# EAGLE board BusPirate-ultra.v1.0a (EAGLE 9.1.3)
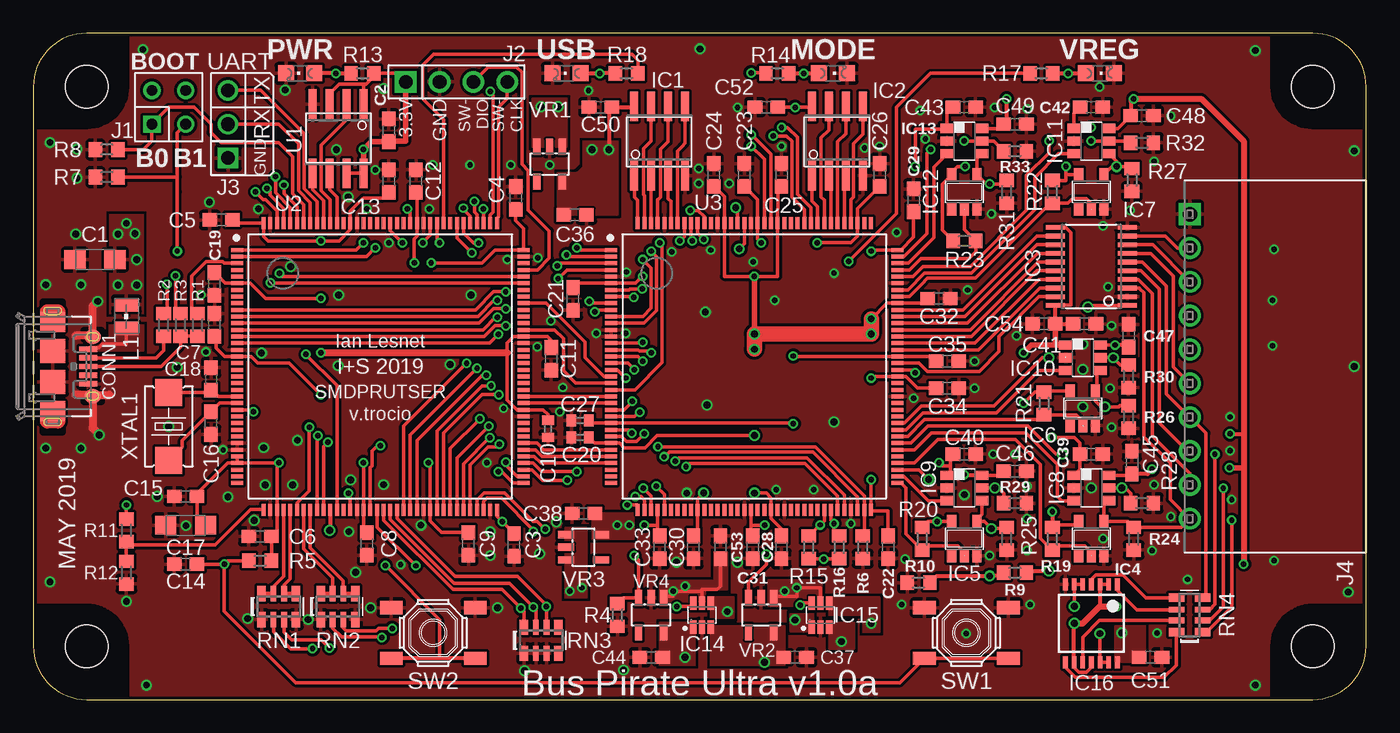
[diagram p5: board, top side]
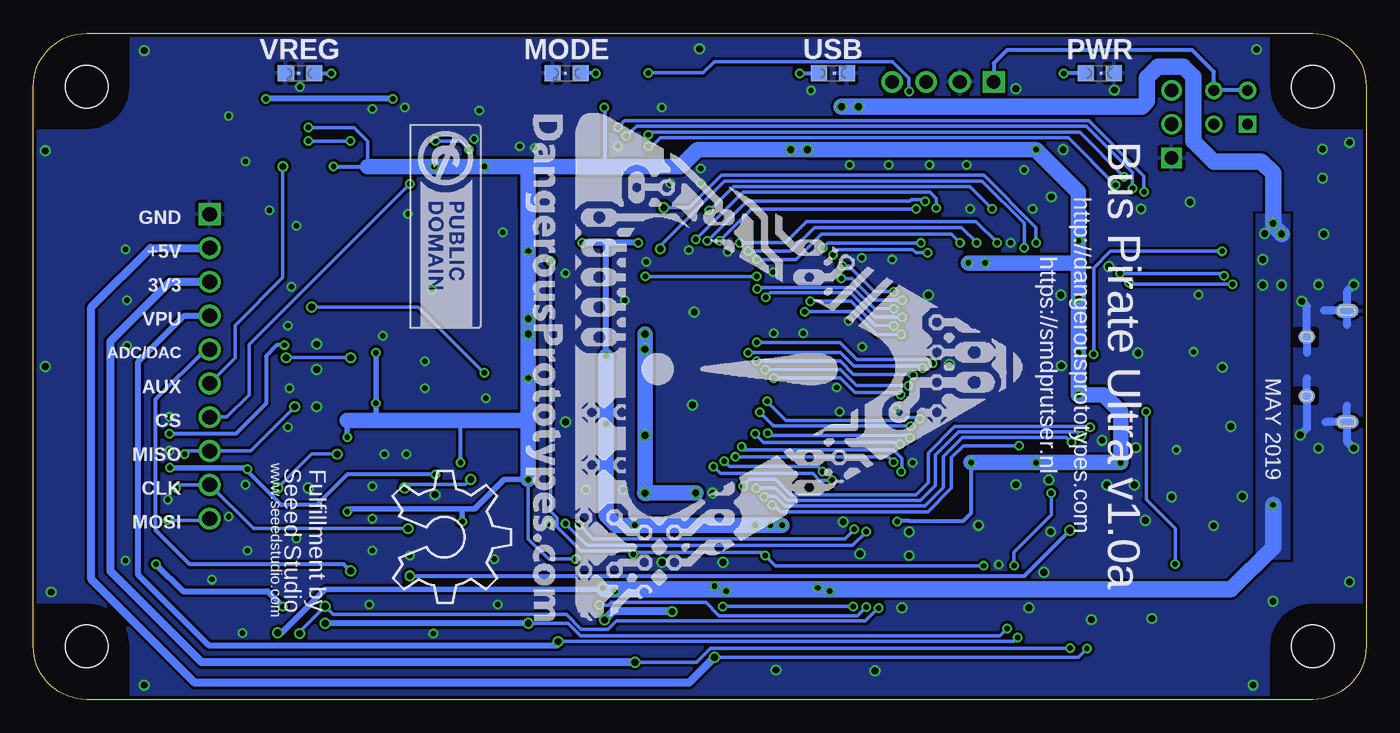
[diagram p6: board, bottom side, seen from below]

Size 100 x 50 mm. Coordinates in mm from the lower left corner, seen from the top.
Copper layers (1*16): Top 0.035mm / dielectric 1.5mm / Bottom 0.035mm
Design rules "dirt_cheap_dirty_boards.v1.1": minimum track width 6mil, minimum drill 12mil, track to track 6mil, track to pad 6mil, pad to pad 6mil, via to via 6mil, smd to smd 0mil, copper to edge 10mil, drill to drill 10mil, minimum pad ring 10mil, minimum via ring 6mil, stop-mask expansion 2mil, vias tented up to drill 25mil, thermal gap 10mil
tRestrict: area 0.8,20.1 to 2.2,20.7; area 0.8,29.2 to 2.2,29.8; area 3.8,22.4 to 5.1,23; area 3.8,27.1 to 5.1,27.7
bRestrict: area 3.8,26.7 to 5.1,27.7; area 3.8,22.4 to 5.1,23.2

## Footprints (pad centres in the part's own frame; a part is rotated, then mirrored left to right if it is on the bottom)
SMC_A = smd 1.6 x 1.4: + -1.5,0; - 1.5,0
C0603 = smd 1.1 x 1: 1 -0.85,0; 2 0.85,0
C402 = smd 0.7 x 0.9: 1 -0.65,0; 2 0.65,0
CON_USB_MICRO-B-2-SD-47589-001 = smd 1.05 x 1.25: BODY@1 -2.225,3.35; BODY@3 2.225,3.35 | smd 1.05 x 1.25 bottom: BODY@2 -2.225,3.35; BODY@4 2.225,3.35 | smd 1.48 x 1.9: BODY@5 -3.338,0.35; BODY@9 3.338,0.35 | smd 1 x 1.7 bottom: BODY@6 -4.175,0.35; BODY@10 4.175,0.35 | smd 1.8 x 1.9: BODY@7 -1.15,0.35; BODY@8 1.15,0.35 | smd 0.4 x 1.35: P1 -1.3,3.025; P2 -0.65,3.025; P3 0,3.025; P4 0.65,3.025; P5 1.3,3.025
SOIC-8 = smd 0.6 x 2.2: 1 -1.905,-2.6; 2 -0.635,-2.6; 3 0.635,-2.6; 4 1.905,-2.6; 5 1.905,2.6; 6 0.635,2.6; 7 -0.635,2.6; 8 -1.905,2.6
TSSOP-20 = smd 0.35 x 1.43: 1 -2.925,-2.7; 2 -2.275,-2.7; 3 -1.625,-2.7; 4 -0.975,-2.7; 5 -0.325,-2.7; 6 0.325,-2.7; 7 0.975,-2.7; 8 1.625,-2.7; 9 2.275,-2.7; 10 2.925,-2.7; 11 2.925,2.7; 12 2.275,2.7; 13 1.625,2.7; 14 0.975,2.7; 15 0.325,2.7; 16 -0.325,2.7; 17 -0.975,2.7; 18 -1.625,2.7; 19 -2.275,2.7; 20 -2.925,2.7
SOT23-5 = smd 0.69 x 0.99: 1 -0.95,-1.29; 2 0,-1.29; 3 0.95,-1.29; 4 0.95,1.3; 5 -0.95,1.3
DBV-R-PDSO-G6 = smd 0.69 x 0.99: 1 -0.95,-1.29; 2 0,-1.29; 3 0.95,-1.29; 4 0.95,1.3; 5 0,1.3; 6 -0.95,1.3
SC-70-6 = smd 0.47 x 1: 1 -0.65,-0.9; 2 0,-0.9; 3 0.65,-0.9; 4 0.65,0.9; 5 0,0.9; 6 -0.65,0.9
40XX_TSSOP14 = smd 0.35 x 0.9: 1 -1.95,-2.925; 2 -1.3,-2.925; 3 -0.65,-2.925; 4 0,-2.925; 5 0.65,-2.925; 6 1.3,-2.925; 7 1.95,-2.925; 8 1.95,2.925; 9 1.3,2.925; 10 0.65,2.925; 11 0,2.925; 12 -0.65,2.925; 13 -1.3,2.925; 14 -1.95,2.925
M2X2 = drill 0.8 square: 1 -1.27,-1.27 | drill 0.8: 2 -1.27,1.27; 3 1.27,-1.27; 4 1.27,1.27
M1X4 = drill 1.02 pad 1.632 square: 1 0,0 | drill 1.02 pad 1.632: 2 2.54,0; 3 5.08,0; 4 7.62,0
M1X3 = drill 1.02 square: 1 0,0 | drill 1.02: 2 2.54,0; 3 5.08,0
M1X10_MALE_RIGHT_ANGLES_PTH_SHROUDED = drill 1.09 square: 1 -11.43,-6.415 | drill 1.09: 2 -8.89,-6.415; 3 -6.35,-6.415; 4 -3.81,-6.415; 5 -1.27,-6.415; 6 1.27,-6.415; 7 3.81,-6.415; 8 6.35,-6.415; 9 8.89,-6.415; 10 11.43,-6.415
WE-KI_0805_B = smd 1.02 x 1.78: 1 -0.89,0; 2 0.89,0
LED-805 = smd 1.2 x 1.2: A 0,-1.05; C 0,1.05
DP10050_V1 = hole 3.2: 4,4; 96,4; 96,46; 4,46
R603 = smd 1 x 1.1: 1 -0.85,0; 2 0.85,0
R0603 = smd 1 x 1.1: 1 -0.85,0; 2 0.85,0
RN8P-4R-CRA06S = smd 0.63 x 1.15: 1 -1.295,-0.975; 4 1.295,-0.975; 5 1.295,0.975; 8 -1.295,0.975 | smd 0.44 x 1.15: 2 -0.4,-0.975; 3 0.4,-0.975; 6 0.4,0.975; 7 -0.4,0.975
SW_TACT_SMALL = smd 1.7 x 1: 1 -3.15,1.9; 2 3.15,1.9; 3 -3.15,-1.9; 4 3.15,-1.9
TQFP-144 = smd 0.9 x 0.3: 1 -10.75,8.75; 2 -10.75,8.25; 3 -10.75,7.75; 4 -10.75,7.25; 5 -10.75,6.75; 6 -10.75,6.25; 7 -10.75,5.75; 8 -10.75,5.25; 9 -10.75,4.75; 10 -10.75,4.25; 11 -10.75,3.75; 12 -10.75,3.25; 13 -10.75,2.75; 14 -10.75,2.25; 15 -10.75,1.75; 16 -10.75,1.25; 17 -10.75,0.75; 18 -10.75,0.25; 19 -10.75,-0.25; 20 -10.75,-0.75; 21 -10.75,-1.25; 22 -10.75,-1.75; 23 -10.75,-2.25; 24 -10.75,-2.75; 25 -10.75,-3.25; 26 -10.75,-3.75; 27 -10.75,-4.25; 28 -10.75,-4.75; 29 -10.75,-5.25; 30 -10.75,-5.75; 31 -10.75,-6.25; 32 -10.75,-6.75; 33 -10.75,-7.25; 34 -10.75,-7.75; 35 -10.75,-8.25; 36 -10.75,-8.75; 73 10.75,-8.75; 74 10.75,-8.25; 75 10.75,-7.75; 76 10.75,-7.25; 77 10.75,-6.75; 78 10.75,-6.25; 79 10.75,-5.75; 80 10.75,-5.25; 81 10.75,-4.75; 82 10.75,-4.25; 83 10.75,-3.75; 84 10.75,-3.25; 85 10.75,-2.75; 86 10.75,-2.25; 87 10.75,-1.75; 88 10.75,-1.25; 89 10.75,-0.75; 90 10.75,-0.25; 91 10.75,0.25; 92 10.75,0.75; 93 10.75,1.25; 94 10.75,1.75; 95 10.75,2.25; 96 10.75,2.75; 97 10.75,3.25; 98 10.75,3.75; 99 10.75,4.25; 100 10.75,4.75; 101 10.75,5.25; 102 10.75,5.75; 103 10.75,6.25; 104 10.75,6.75; 105 10.75,7.25; 106 10.75,7.75; 107 10.75,8.25; 108 10.75,8.75 | smd 0.3 x 0.9: 37 -8.75,-10.75; 38 -8.25,-10.75; 39 -7.75,-10.75; 40 -7.25,-10.75; 41 -6.75,-10.75; 42 -6.25,-10.75; 43 -5.75,-10.75; 44 -5.25,-10.75; 45 -4.75,-10.75; 46 -4.25,-10.75; 47 -3.75,-10.75; 48 -3.25,-10.75; 49 -2.75,-10.75; 50 -2.25,-10.75; 51 -1.75,-10.75; 52 -1.25,-10.75; 53 -0.75,-10.75; 54 -0.25,-10.75; 55 0.25,-10.75; 56 0.75,-10.75; 57 1.25,-10.75; 58 1.75,-10.75; 59 2.25,-10.75; 60 2.75,-10.75; 61 3.25,-10.75; 62 3.75,-10.75; 63 4.25,-10.75; 64 4.75,-10.75; 65 5.25,-10.75; 66 5.75,-10.75; 67 6.25,-10.75; 68 6.75,-10.75; 69 7.25,-10.75; 70 7.75,-10.75; 71 8.25,-10.75; 72 8.75,-10.75; 109 8.75,10.75; 110 8.25,10.75; 111 7.75,10.75; 112 7.25,10.75; 113 6.75,10.75; 114 6.25,10.75; 115 5.75,10.75; 116 5.25,10.75; 117 4.75,10.75; 118 4.25,10.75; 119 3.75,10.75; 120 3.25,10.75; 121 2.75,10.75; 122 2.25,10.75; 123 1.75,10.75; 124 1.25,10.75; 125 0.75,10.75; 126 0.25,10.75; 127 -0.25,10.75; 128 -0.75,10.75; 129 -1.25,10.75; 130 -1.75,10.75; 131 -2.25,10.75; 132 -2.75,10.75; 133 -3.25,10.75; 134 -3.75,10.75; 135 -4.25,10.75; 136 -4.75,10.75; 137 -5.25,10.75; 138 -5.75,10.75; 139 -6.25,10.75; 140 -6.75,10.75; 141 -7.25,10.75; 142 -7.75,10.75; 143 -8.25,10.75; 144 -8.75,10.75
SOT-23-5@1 = smd 0.55 x 1.2: 1 -0.95,-1.3; 2 0,-1.3; 3 0.95,-1.3; 4 0.95,1.3; 5 -0.95,1.3
XTAL_4X6 = smd 2.032 x 2.032: 1 -2.54,0; 2 2.54,0

## Placement (x,y rotation side)
C1  10uF  [SMC_A]  4.62,33.02 180 top
C2  0.1uF  [C0603]  26.67,42.72 270 top
C3  0.1uF  [C0603]  36.07,11.61 90 top
C4  0.1uF  [C0603]  36.2,37.64 270 top
C5  0.1uF  [C0603]  14.1,35.99 0 top
C6  0.1uF  [C0603]  17.02,12.24 0 top
C7  0.1uF  [C0603]  13.59,28.11 270 top
C8  0.1uF  [C0603]  25.02,11.68 90 top
C9  0.1uF  [C0603]  32.64,11.68 90 top
C10  0.1uF  [C402]  38.61,20.32 270 top
C11  0.1uF  [C0603]  38.86,25.57 90 top
C12  0.1uF  [C0603]  28.7,38.91 270 top
C13  0.1uF  [C0603]  26.67,38.91 270 top
C14  0.1uF  [C0603]  11.43,10.16 0 top
C15  0.1uF  [C0603]  11.43,15.24 0 top
C16  22pF  [C0603]  13.34,20.75 90 top
C17  1uF  [SMC_A]  11.43,13.08 180 top
C18  22pF  [C0603]  13.34,24.05 270 top
C19  0.1uF  [C0603]  13.59,31.19 90 top
C20  0.1uF  [C402]  41.02,19.68 180 top
C21  0.1uF  [C0603]  40.49,30.07 90 top
C22  0.1uF  [C0603]  64.14,11.43 90 top
C23  0.1uF  [C0603]  53.34,39.37 270 top
C24  0.1uF  [C0603]  51.05,39.37 270 top
C25  0.1uF  [C0603]  56.13,39.37 270 top
C26  0.1uF  [C0603]  63.5,39.37 270 top
C27  0.1uF  [C402]  41.02,20.95 180 top
C28  0.1uF  [C0603]  56.13,11.43 90 top
C29  0.1uF  [C0603]  66.04,37.47 270 top
C30  0.1uF  [C0603]  49.53,11.43 90 top
C31  0.1uF  [C0603]  53.98,11.43 90 top
C32  0.1uF  [C0603]  67.94,30.1 180 top
C33  0.1uF  [C0603]  46.99,11.43 90 top
C34  0.1uF  [C0603]  68.58,23.37 180 top
C35  0.1uF  [C0603]  68.58,25.4 180 top
C36  1uf  [C0603]  40.64,36.37 0 top
C37  1uF  [C0603]  57.15,3.17 0 top
C38  1uf  [C0603]  41.27,13.97 180 top
C39  0.1uF  [C0603]  79.38,18.41 0 top
C40  0.1uF  [C0603]  69.85,18.41 0 top
C41  0.1uF  [C0603]  78.87,28.19 0 top
C42  0.1uF  [C0603]  79.38,44.45 0 top
C43  0.1uF  [C0603]  69.85,44.45 0 top
C44  1uF  [C0603]  46.35,3.17 180 top
C45  0.1uF  [C0603]  82.42,17.78 270 top
C46  0.1uF  [C0603]  73.66,17.14 180 top
C47  0.1uF  [C0603]  82.17,27.3 270 top
C48  0.1uF  [C0603]  83.19,43.81 180 top
C49  0.1uF  [C0603]  73.66,43.18 180 top
C50  0.1uF  [C0603]  42.55,44.45 180 top
C51  0.1uF  [C0603]  83.82,3.17 0 top
C52  0.1uF  [C0603]  54.99,44.45 180 top
C53  0.1uF  [C0603]  51.56,11.43 90 top
C54  0.1uF  [C0603]  75.82,28.19 180 top
CONN1  CON-USB-F-MICRO-B-2  [CON_USB_MICRO-B-2-SD-47589-001]  1.1,25 270 top
IC1  IC_MEM_23LC1024  [SOIC-8]  46.99,41.91 0 top
IC2  IC_MEM_23LC1024  [SOIC-8]  60.33,41.91 0 top
IC3  IC_74AC573  [TSSOP-20]  79.38,32.51 90 top
IC4  74LVC1G07DBV  [SOT23-5]  79.38,12.06 0 top
IC5  74LVC1G07DBV  [SOT23-5]  69.85,12.06 0 top
IC6  74LVC1G07DBV  [SOT23-5]  78.74,21.84 0 top
IC7  74LVC1G07DBV  [SOT23-5]  79.38,38.1 0 top
IC8  IC_BUFF_SN74LVC1T45DBV  [DBV-R-PDSO-G6]  79.38,15.88 270 top
IC9  IC_BUFF_SN74LVC1T45DBV  [DBV-R-PDSO-G6]  69.85,15.88 270 top
IC10  IC_BUFF_SN74LVC1T45DBV  [DBV-R-PDSO-G6]  78.74,25.65 270 top
IC11  IC_BUFF_SN74LVC1T45DBV  [DBV-R-PDSO-G6]  79.38,41.91 270 top
IC12  74LVC1G07DBV  [SOT23-5]  69.85,38.1 0 top
IC13  IC_BUFF_SN74LVC1T45DBV  [DBV-R-PDSO-G6]  69.85,41.91 270 top
IC14  IC_BL1551  [SC-70-6]  50.16,6.35 0 top
IC15  IC_BL1551  [SC-70-6]  59.05,6.35 0 top
IC16  74HCT4066PW  [40XX_TSSOP14]  79.38,5.71 180 top
J1  CON_HEADER_2X02-PTH  [M2X2]  10.16,44.45 0 top
J2  CON_HEADER_1X04  [M1X4]  27.94,46.35 0 top
J3  CON_HEADER_1X03-PTH  [M1X3]  14.61,40.64 90 top
J4  CON_HEADER_1X10-RIGHT_ANGLED_PTH_SHROUDED  [M1X10_MALE_RIGHT_ANGLES_PTH_SHROUDED]  93.19,25 270 top
L1  1.5A ferrite bead  [WE-KI_0805_B]  6.99,28.75 270 top
LED1  Optional YELLOW  [LED-805]  20,47 270 bottom
LED2  YELLOW  [LED-805]  20,47 90 top
LED3  YELLOW  [LED-805]  60,47 270 top
LED4  Optional YELLOW  [LED-805]  60,47 90 bottom
LED5  YELLOW  [LED-805]  80,47 270 top
LED6  Optional YELLOW  [LED-805]  80,47 90 bottom
LED7  YELLOW  [LED-805]  40,47 90 top
LED8  Optional YELLOW  [LED-805]  40,47 270 bottom
LOGO1  LOGO_CC-0  [LOGO_CC-0]  71.75,43.18 270 bottom
PCB1  PCB_DP_RECTANGLE-50X100  [DP10050_V1]  0,0 0 top
R1  1.5K  [R603]  12.32,28.11 90 top
R2  22R  [R603]  9.78,28.11 270 top
R3  22R  [R603]  11.05,28.11 270 top
R4  10K  [R603]  43.81,6.35 270 top
R5  10K  [R603]  17.02,10.41 0 top
R6  10K  [R603]  62.23,11.43 270 top
R7  10K  [R0603]  5.51,39.21 180 top
R8  10K  [R0603]  5.51,41.27 180 top
R9  10K  [R0603]  73.66,9.53 180 top
R10  10K  [R0603]  66.42,8.76 0 top
R11  10K  [R0603]  6.99,12.7 270 top
R12  10K  [R0603]  6.99,9.53 90 top
R13  1K1  [R603]  24.7,47 0 top
R14  1K1  [R603]  55.81,47 180 top
R15  10K  [R0603]  58.17,11.43 270 top
R16  10K  [R0603]  60.45,11.43 270 top
R17  1K1  [R603]  75.62,47 180 top
R18  1K1  [R603]  44.51,47 0 top
R19  100K  [R0603]  76.45,12.06 90 top
R20  100K  [R0603]  66.67,12.06 90 top
R21  100K  [R0603]  75.82,22.23 90 top
R22  100K  [R0603]  76.45,38.1 90 top
R23  100K  [R0603]  69.85,34.42 180 top
R24  1M  [R0603]  82.55,12.06 90 top
R25  1M  [R0603]  73.03,12.06 90 top
R26  1M  [R0603]  82.17,21.21 90 top
R27  1M  [R0603]  82.42,38.99 90 top
R28  100K  [R0603]  83.19,14.73 180 top
R29  100K  [R0603]  73.66,14.73 180 top
R30  100K  [R0603]  82.17,24.26 90 top
R31  1M  [R0603]  73.03,38.1 90 top
R32  100K  [R0603]  83.19,41.78 180 top
R33  100K  [R0603]  73.66,41.15 180 top
RN1  10k  [RN8P-4R-CRA06S]  18.41,6.99 0 top
RN2  10k  [RN8P-4R-CRA06S]  22.86,6.99 0 top
RN3  10k  [RN8P-4R-CRA06S]  38.1,4.45 0 top
RN4  10k  [RN8P-4R-CRA06S]  86.74,6.35 90 top
SW1  [SW_TACT_SMALL]  70,5 180 top
SW2  [SW_TACT_SMALL]  30,5 180 top
U1  IC_MEM_W25X40CL  [SOIC-8]  22.86,42.09 180 top
U2  IC_UC_STM32F103ZX  [TQFP-144]  26.04,25 0 top
U3  IC_FPGA_ICE40HX4K  [TQFP-144]  54.09,25 0 top
U$1  [DP-LOGO]  61.84,-11.22 0 top  (outside the outline)
U$2  [OSHW_8X350_NOTEXT]  73.03,17.14 270 bottom
U$4  [DP_LOGO_ART_1.5X1.5]  63.01,43.98 270 bottom
VR1  MCP1801T-3302I/OT  [SOT-23-5@1]  38.73,40.18 180 top
VR2  MCP1801T-3302I/OT  [SOT-23-5@1]  54.61,6.35 180 top
VR3  MCP1801T-1202I/OT  [SOT-23-5@1]  41.27,11.43 270 top
VR4  MCP1801T-5002I/OT  [SOT-23-5@1]  46.35,6.35 180 top
XTAL1  8Mhz  [XTAL_4X6]  10.16,20.5 90 top

## Tracks (layer width: path | path; a pad name or v marks a point on that pad's centre or on a via)
1V2  (via drill 0.41)
  Top 0.254: C33.2 46.84,12.43 U3.40 46.84,13.08 v45.85,13.08 | 53.84,13.08 53.84,12.42 C31.2 | C35.2 67.38,25.75 U3.92 57.05,25.75 v57.02,25.78 | C23.2 54.34,37.52 U3.126 54.34,34.56 v54.61,34.29 | C27.1 41.67,20.75 U3.27 45.26,20.75 56.97,20.75 v57.02,20.7 | v54.86,13.08 53.84,13.08 | C26.2 61.84,36.86 U3.111 61.84,34.79 61.34,34.29 v58.8,34.29 | U3.54 53.84,13.08
  Bottom 0.457: v57.02,25.78 57.02,34.29 | v58.8,34.29 57.02,34.29 | v54.61,34.29 57.02,34.29
  Bottom 1.168: v43.81,13.08 v45.85,13.08 46.86,13.08 48.26,13.08 v54.86,13.08 56.26,13.08 57.02,13.84 57.02,17.27 v57.02,20.7 v57.02,25.78
  other vias: 44.7,13.08
  pour Top (no thermals): 45.09,13.97 41.91,13.97 41.91,12.06 45.09,12.06
3V3  (via drill 0.41, 0.51)
  Top 0.254: C12.2 28.79,37.98 U2.121 28.79,34.76 28.57,34.55 v28.57,32.77 | C5.2 15.19,35.75 U2.144 17.29,34.75 17.61,34.42 v21.59,34.42 22.95,34.42 23.79,35.26 U2.131 23.79,36.66 24.68,37.55 | C11.2 38.86,26.97 38.58,27.25 U2.95 36.04,27.25 35.56,26.77 35.56,26.04 35.56,22.48 36.29,21.75 U2.84 38.25,21.75 38.61,21.39 C10.1 | 24.68,37.55 24.77,37.64 | 24.77,37.64 26.25,37.64 C13.2 | C22.2 64.14,14.14 62.94,14.14 U3.72 62.84,16.48 v62.87,16.51 | C7.2 13.72,27.14 13.72,26.38 14.34,25.75 U2.17 16.34,25.75 16.82,25.27 19.18,25.27 v21.59,22.86 | C8.2 24.79,12.56 U2.52 24.79,17.76 v24.77,17.78 | C30.2 49.84,12.59 U3.46 49.84,15.06 v50.29,15.51 | C32.2 66.75,29.75 U3.100 64.04,29.75 v62.87,28.57 | U2.72 34.78,13.74 | 34.78,13.74 C3.2 | IC8.1 78.53,17.27 C39.1 78.53,19.27 78.11,19.68 v76.45,19.68 | C42.1 78.08,44.01 IC11.1 79.31,42.86 v79.38,42.93 | C43.1 68.56,44.01 IC13.1 68.5,42.8 66.17,42.8 v66.17,40.01 | R19.2 76.65,13.11 78.17,13.11 IC4.5 | C20.1 42.11,19.25 U3.30 43.96,19.25 44.34,18.88 45.88,18.88 46.81,19.81 v54.1,19.81 | J2.1 27.3,47 R13.2 25.55,46.75 24.97,46.17 24.77,46.17 | U2.33 14.57,17.75 12.28,15.46 C15.2 12.28,13.73 C17.+ | C25.2 55.88,38.27 55.88,36.83 55.84,36.79 U3.123 55.84,31.75 v54.1,31.75 51.84,31.75 U3.131 51.84,37.73 C24.2 | C34.2 66.33,23.37 65.45,24.25 U3.89 62.98,24.25 v62.87,24.13 | IC5.5 v67.82,13.37 67.12,13.37 R20.2 | 68.81,17.53 68.81,16.89 68.75,16.82 IC9.1 | 68.81,17.53 68.81,18.23 C40.1 | v62.87,33.66 62.96,33.75 U3.108 65.08,33.75 66.04,34.71 C29.2 | R22.2 77.47,38.95 77.47,39.37 | v77.47,40.01 77.47,39.37 | IC7.5 77.5,39.4 77.47,39.37 | v69.9,40.01 69.34,40.01 68.9,39.56 IC12.5 68.2,38.7 68.2,35.22 R23.2
  Top 0.254: IC3.11 77.47,35.44 77.85,35.05 77.85,29.59 IC3.20 | IC6.5 75.89,23.14 R21.2 75.14,23.07 v74.3,22.23 | 68.81,17.53 68.2,17.53 v67.94,17.78 | IC2.8 58.36,44.45 v57.15,44.45 C52.1 | U2.33 18.39,17.75 v18.41,17.78 18.29,17.65 U2.39 18.29,12.66 C6.2 R5.2 | U2.32 U2.33 | v29.65,17.78 29.79,17.64 U2.62 29.79,13.39 30.65,12.53 C9.2 | 34.78,13.74 34.8,13.74 v35.19,13.35 | v29.84,32.77 33.66,32.77 34.41,33.52 34.42,33.52 34.65,33.75 U2.108 36.78,35.35 36.2,35.94 C4.2 | C19.2 14.38,31.25 U2.6 16.27,31.25 17.42,30.1 v21.59,30.1 | v45.72,31.75 45.69,31.75 45.19,31.25 U3.6 42.55,31.25 40.81,31.25 C21.2 | C28.2 56.13,12.79 55.34,13.58 U3.57 55.34,15.15 54.99,15.49 v54.1,15.49 | R16.2 60.41,10.54 v59.31,10.54 58.2,10.54 R15.2 | 24.68,37.55 24.77,37.64 | U1.7 U1.8 | 24.77,46.17 22.93,46.17 22.23,45.47 U1.3 | U1.1 24.77,46.17
  Top 0.305: IC1.8 45.02,44.45 C50.1 43.18,44.23 v43.18,41.27 | IC3.20 C54.1 C41.1 | v76.45,14.1 R19.2
  Top 0.406: IC10.1 76.58,26.6 | 76.58,26.6 74.86,26.6 v74.3,26.04 | C54.1 76.67,26.69 76.58,26.6 | J2.1 27.94,41.91 26.71,41.91 C2.2 25.36,41.87 v24.77,41.27 U1.8 | v54.1,27.43 v54.1,31.75
  Top 0.508: v21.59,26.04 35.56,26.04
  Top 1.168: v62.87,28.57 v62.87,27.43 v54.1,27.43 v54.1,26.29
  Bottom 0.254: v45.72,31.75 49.53,31.75 v54.1,31.75 | v62.87,16.51 62.87,12.06 61.34,10.54 v59.31,10.54 | v79.38,42.93 75.95,42.93 74.93,41.91 74.93,40.01
  Bottom 0.305: J1.2 J1.4 11.43,47.12 13.06,48.74 26.95,48.74 27.94,47.75 J2.1 | v67.94,17.78 67.94,20.95 | v77.47,40.01 74.93,40.01 | v57.15,44.45 57.15,40.01 | v29.65,17.78 29.65,13.97 30.21,13.41 34.29,13.41 35.13,13.41 v35.19,13.35
  Bottom 0.406: v74.3,26.04 v74.3,22.23 74.3,20.95 | 76.45,20.95 v76.45,19.68 | v62.87,16.51 64.67,16.51 66.63,14.56 66.88,14.3 67.94,14.3 | v76.45,14.1 v76.44,14.1 76.24,14.3 67.94,14.3 | 67.94,14.3 67.82,14.3 67.82,14.1 v67.82,13.37
  Bottom 1.168: 62.87,20.95 v62.87,24.13 v62.87,28.57 62.87,29.84 v62.87,33.66 62.87,36.83 62.87,40.01 | 62.87,20.95 v62.87,16.51 | 62.87,40.01 v66.17,40.01 v69.9,40.01 74.93,40.01 | 62.87,20.95 67.94,20.95 74.3,20.95 76.45,20.95 | v29.65,17.78 v24.77,17.78 21.59,17.78 v18.41,17.78 18.41,21.59 19.68,22.86 v21.59,22.86 v21.59,26.04 v21.59,30.1 21.59,32.77 | 21.59,32.77 v21.59,34.42 21.59,37.34 21.59,38.1 v24.77,41.27 27.94,41.27 v41.91,41.27 50.16,41.27 51.44,40.01 56.52,40.01 57.15,40.01 62.87,40.01 | 21.59,32.77 v28.57,32.77 v29.84,32.77 | v50.29,15.51 50.29,15.49 53.98,15.49 | v54.1,27.43 v54.1,19.81 v54.1,15.49
  Bottom 1.219: v54.1,15.49 53.98,15.49
  pour Top (no thermals): 39.37,39.55 40.81,39.55 41.27,40.01 41.27,41.91 43.81,41.91 43.81,36.37 39.37,36.37
ADC1  (via drill 0.51)
  Top 0.305: U2.47 22.29,12.76 v22.23,12.7 | R10.2 67.78,9.27 v71.75,9.27 72.56,9.27 R9.2
  Bottom 0.305: v71.75,9.27 25.65,9.27 v22.23,12.7
ADC2
  Top 0.254: RN2.8 RN2.7 22.46,9.13 20.29,11.31 U2.43
ADC3
  Top 0.254: RN1.5 RN1.6 18.82,8.59 19.29,9.06 U2.41
ADC4
  Top 0.254: RN1.8 RN1.7 18.02,8.49 18.79,9.26 U2.40
ADC5
  Top 0.254: U2.37 17.27,14.26 16.3,14.26 13.64,11.61 7.23,11.61 R11.2 R12.2
ADC6
  Top 0.254: RN2.5 RN2.6 23.26,8.91 20.79,11.38 U2.44
BOOT0
  Top 0.254: U2.138 20.29,37.13 19.44,37.98 19.44,40.76 18.41,41.78 14.1,41.78 13.34,42.55 13.34,43.18 12.06,44.45 10.16,44.45 J1.1 8.89,41.91 8.26,41.27 R8.1
BOOT1  (via drill 0.41)
  Top 0.254: v10.79,33.66 10.79,38.1 10.79,39.24 | 10.79,39.24 10.79,42.55 J1.3 | R7.1 10.76,39.21 10.79,39.24 | U2.48 22.79,23.57 v20.45,25.91
  Bottom 0.254: v20.45,25.91 20.45,32.38 19.18,33.66 v10.79,33.66
BPIO_AUX  (via drill 0.51)
  Top 0.254: v81.28,40.01 82.26,40.01 R27.2 | IC11.4 81.28,40.35 v81.28,40.01 | IC7.4 80.93,40.01 v81.28,40.01 | IC3.7 83.85,33.49 85.55,31.79 85.55,24.95 J4.6
  Bottom 0.254: J4.6 84.86,25.64 84.86,28.07 81.28,31.65 v81.28,40.01
BPIO_CLOCK  (via drill 0.41, 0.51)
  Top 0.254: IC9.4 71.15,13.91 70.8,13.56 IC5.4 71.34,13.37 v71.88,12.83 73.11,12.83 72.73,13.21 72.81,13.12 R25.2 | J4.9 86.76,16.98 83.95,19.8 83.95,30.48 82.89,31.54 IC3.4 | RN4.2 88.27,5.95 89.28,6.97 v89.28,15.88
  Bottom 0.254: v89.28,15.88 89.05,16.11 J4.9 83.49,12.83 v71.88,12.83
BPIO_CS  (via drill 0.41)
  Top 0.254: IC13.4 70.8,40.61 IC12.4 71.5,38.7 v71.75,38.7 72.77,38.7 R31.2 | IC3.6 83.22,32.84 85.01,31.04 85.01,22.92 86.74,21.19 J4.7 87.97,19.99 87.97,7.9 RN4.4
  Bottom 0.254: v71.75,38.7 83.82,26.63 83.82,22.86 85.49,21.19 J4.7
BPIO_MISO  (via drill 0.41, 0.51)
  Top 0.254: IC10.4 79.79,24.45 79.79,23.24 IC6.4 79.69,22.42 80.14,21.97 v80.39,21.97 81.45,21.97 81.53,22.06 R26.2 | RN4.3 88.27,6.75 88.65,7.13 v88.65,18.41 | J4.8 86.59,18.65 84.48,20.77 84.48,30.79 83.08,32.19 IC3.5
  Bottom 0.254: v88.65,18.41 88.41,18.65 J4.8 83.71,18.65 v80.39,21.97
BPIO_MOSI  (via drill 0.41)
  Top 0.254: IC8.4 80.33,14.57 IC4.4 82.1,13.37 R24.2 86.11,12.91 J4.10 86.74,13.57 85.29,15.02 85.29,17.75 83.32,19.72 83.32,30.53 83.03,30.82 | 83.03,30.82 82.96,30.89 IC3.3 | 83.03,30.82 | v89.92,13.46 89.92,6.96 88.01,5.05 RN4.1
  Bottom 0.254: v89.92,13.46 86.88,13.46 J4.10
BUFDIR_AUX  (via drill 0.41)
  Top 0.254: v79.38,41.91 IC11.5 82.21,41.91 R32.2 | U3.104 65.98,31.75 66.74,32.51 70.3,32.51 74.52,36.73 74.52,39.34 76.2,41.02 v76.2,41.91
  Bottom 0.254: v76.2,41.91 v79.38,41.91
BUFDIR_CLOCK  (via drill 0.51)
  Top 0.254: U3.75 66.42,17.25 67.17,16.51 v67.18,16.51 | IC9.5 v72.14,15.88 72.39,15.88 72.81,15.46 R29.2
  Bottom 0.254: v72.14,15.88 71.88,16.13 67.56,16.13 v67.18,16.51
BUFDIR_CS  (via drill 0.41)
  Top 0.254: v69.85,41.91 IC13.5 72.07,41.91 72.86,41.12 R33.2 | U3.107 65.33,33.25 67.06,34.97 67.06,41.02 v67.31,41.27
  Bottom 0.254: v67.31,41.27 67.94,41.91 v69.85,41.91
BUFDIR_MISO  (via drill 0.51)
  Top 0.254: v81.03,25.65 IC10.5 81.02,25.65 81.56,25.11 R30.2 | U3.82 65.35,20.75 66.62,22.02 72.06,22.02 75.69,25.65 v76.2,25.65
  Bottom 0.254: v76.2,25.65 v81.03,25.65
BUFDIR_MOSI  (via drill 0.51)
  Top 0.254: IC8.5 v81.66,15.88 81.92,15.88 82.33,15.46 R28.2 | U3.79 65.86,19.25 67.12,20.52 74.6,20.52 76.71,18.41 v77.22,18.41
  Bottom 0.254: v81.66,15.88 79.12,18.41 v77.22,18.41
BUFIO_AUX
  Top 0.254: U3.102 65.6,30.75 66.87,32.02 70.39,32.02 75.13,36.76 75.13,39.19 76.9,40.96 IC11.3
BUFIO_CLOCK
  Top 0.254: IC9.3 67.16,14.93 65.33,16.75 U3.74
BUFIO_CS
  Top 0.254: U3.106 65.66,32.75 67.56,34.65 67.56,39.94 67.94,40.33 67.94,40.34 IC13.3
BUFIO_MISO
  Top 0.254: U3.81 65.47,20.25 66.74,21.52 72.25,21.52 75.44,24.7 IC10.3
BUFIO_MOSI
  Top 0.254: U3.78 66.11,18.75 67.38,20.02 74.47,20.02 76.83,17.65 76.83,15.24 77.15,14.93 IC8.3
BUFOD_AUX
  Top 0.254: 66.63,31.16 65.73,30.25 U3.101 | 66.63,31.16 67.09,31.61 70.68,31.61 76.32,37.25 R22.1 77.63,37.25 77.96,37.58 79.01,37.58 79.38,37.22 IC7.2 | 66.63,31.16
BUFOD_CLOCK
  Top 0.254: IC5.2 69.85,11.06 69.36,11.55 67.01,11.55 66.78,11.32 R20.1 65.47,12.43 65.47,15.88 65.09,16.25 U3.73
BUFOD_CS
  Top 0.254: IC12.2 69.85,35.25 70.67,34.44 R23.1 70.7,33.62 70.19,33.1 66.59,33.1 65.74,32.25 U3.105
BUFOD_MISO
  Top 0.254: IC6.2 78.74,20.84 78.24,21.34 75.91,21.34 75.88,21.38 R21.1 75.46,21.02 66.87,21.02 65.6,19.75 U3.80
BUFOD_MOSI
  Top 0.254: IC4.2 79.38,11.06 78.89,11.55 76.83,11.55 76.79,11.55 R19.1 75.56,12.1 75.56,17.65 73.69,19.53 67.89,19.53 66.11,17.75 U3.76
D+
  Top 0.254: R1.1 R3.2 11.05,26.46 9.59,25 CONN1.P3
D-
  Top 0.254: R2.2 9.78,26.21 9.22,25.65 CONN1.P2
EXVUSB
  Top 0.254: CONN1.P1 4.25,26.42 4.93,26.42 5.18,26.67 6.99,26.67 L1.2
  pour Top (no thermals): 4.86,27.16 5.71,27.16 5.71,28.11 8.26,28.11 8.26,26.16 4.86,26.16 4.86,26.28
FLASH_MISO
  Top 0.254: U2.134 22.29,37.52 21.59,38.21 21.59,41.61 23.5,43.52 U1.2
FLASH_MOSI
  Top 0.254: U2.135 21.79,37.44 21.04,38.19 | 21.04,38.19 20.95,38.27 | 21.04,38.19 20.95,38.27 | 20.95,38.27 U1.5
FLASH_SCK
  Top 0.254: U2.133 22.79,37.72 22.31,38.19 | 22.31,38.19 22.23,38.27 | 22.31,38.19 22.23,38.27 | 22.23,38.27 U1.6
FPGA_CDONE  (via drill 0.41)
  Top 0.254: U3.65 59.34,13.41 v59.03,13.11 58.21,12.28 R15.1 | U2.69 33.28,15 33.81,15.52 35.38,15.52 37.51,13.38 37.79,13.38 v38.4,12.78
  Bottom 0.254: v59.03,13.11 57.99,12.06 39.12,12.06 v38.41,12.78 v38.4,12.78
FPGA_CRESET  (via drill 0.41)
  Top 0.254: U3.66 59.84,13.44 v60.07,13.21 60.07,12.66 R16.1 | U2.70 33.78,14.86 34.04,15.11 35.14,15.11 37.51,12.74 v37.51,12.62
  Bottom 0.254: v60.07,13.21 60.07,13.18 58.45,11.56 38.54,11.56 37.51,12.59 v37.51,12.62
FPGA_PROG_CLOCK  (via drill 0.41)
  Top 0.254: U3.70 61.84,15.22 58.5,18.57 47.75,18.57 47.39,18.21 v47.32,18.21 | U2.74 36.28,16.75 35.46,17.57 v35.46,17.83
  Bottom 0.254: v47.32,18.21 35.84,18.21 v35.46,17.83
FPGA_PROG_CS  (via drill 0.41)
  Top 0.254: R6.1 62.34,12.39 U3.71 62.34,15.3 58.66,18.97 47.62,18.97 v46.87,18.97 | U2.73 35.99,16.25 35.13,17.1 v34.88,17.1
  Bottom 0.254: v46.87,18.97 46.64,18.74 35.48,18.74 34.82,18.09 34.82,17.16 v34.88,17.1
FPGA_PROG_MISO  (via drill 0.41)
  Top 0.254: U2.75 37.41,17.25 38.2,16.46 v40.06,16.46 | U3.67 60.34,15.28 57.89,17.73 49.23,17.73 v48.97,17.47
  Bottom 0.254: v48.97,17.47 48.45,16.95 41.52,16.95 41.02,16.46 v40.06,16.46
FPGA_PROG_MOSI  (via drill 0.41)
  Top 0.254: v40.77,17.11 38.14,17.11 37.51,17.75 U2.76 | U3.68 60.84,15.36 58.06,18.13 48.41,18.13 v48.16,17.88
  Bottom 0.254: v48.16,17.88 47.78,17.5 41.15,17.5 v40.77,17.11
FSMC_A0  (via drill 0.41)
  Top 0.254: U3.3 39.53,32.75 v39.32,32.53 | U2.10 33.19,29.25 34.54,30.6 v35.43,30.6
  Bottom 0.254: v35.43,30.6 36.88,30.6 38.81,32.53 v39.32,32.53
FSMC_A1  (via drill 0.41)
  Top 0.254: v34.82,29.97 34.59,29.97 33.37,28.75 U2.11 | U3.4 40.02,32.25 v39.37,31.59
  Bottom 0.254: v34.82,29.97 36.96,29.97 38.58,31.59 v39.37,31.59
FSMC_A2  (via drill 0.41)
  Top 0.254: v35.46,29.33 34.54,29.33 33.46,28.25 U2.12 | U3.7 44.7,30.75 44.76,30.81 v45.7,30.81
  Bottom 0.254: v35.46,29.33 36.91,29.33 38.51,30.94 45.57,30.94 v45.7,30.81
FSMC_A3  (via drill 0.41)
  Top 0.254: U2.13 33.75,27.75 34.7,28.7 v34.82,28.7 | U3.8 44.98,30.25 v45.06,30.18
  Bottom 0.254: v34.82,28.7 36.85,28.7 38.69,30.53 44.7,30.53 v45.06,30.18
FSMC_A4  (via drill 0.41)
  Top 0.254: U2.14 33.82,27.25 34.63,28.06 v35.45,28.06 v35.46,28.06 | v41.71,29.9 41.85,29.75 U3.9
  Bottom 0.254: v41.71,29.9 38.66,29.9 36.83,28.06 v35.46,28.06
FSMC_A5  (via drill 0.41)
  Top 0.254: v34.87,27.4 34.22,26.75 U2.15 | v42.14,29.11 42.28,29.25 U3.10
  Bottom 0.254: v34.87,27.4 36.75,27.4 38.46,29.11 v42.14,29.11
FSMC_D0
  Top 0.254: U2.85 U3.24
FSMC_D1
  Top 0.254: U2.86 U3.23
FSMC_D2  (via drill 0.41)
  Top 0.254: U3.1 40.93,33.75 v40.77,33.91 | v33.41,34.26 33.03,34.26 32.28,35 U2.114
  Bottom 0.254: v33.41,34.26 40.42,34.26 v40.77,33.91
FSMC_D3  (via drill 0.41)
  Top 0.254: U3.2 40.14,33.25 v40.01,33.38 | U2.115 31.79,34.64 v32.89,33.53
  Bottom 0.254: v32.89,33.53 33.78,33.53 34.04,33.78 39.61,33.78 v40.01,33.38
FSMC_D4  (via drill 0.41)
  Top 0.254: U2.58 27.79,20.53 v32.51,25.25 | v45.72,26.8 45.67,26.75 U3.15
  Bottom 0.254: v45.72,26.8 39.47,26.8 38.2,25.52 32.78,25.52 v32.51,25.25
FSMC_D5  (via drill 0.41)
  Top 0.254: U2.59 28.29,19.87 v33.29,24.87 | v46.35,26.04 46.24,26.15 45.47,26.15 45.37,26.25 U3.16
  Bottom 0.254: v46.35,26.04 39.43,26.04 38.42,25.02 33.44,25.02 v33.29,24.87
FSMC_D6  (via drill 0.41)
  Top 0.254: U2.60 28.79,19.43 33.68,24.33 v33.98,24.33 | U3.17 45.37,25.75 v45.72,25.4
  Bottom 0.254: v33.98,24.33 34.06,24.41 38.47,24.41 39.46,25.4 v45.72,25.4
FSMC_D7  (via drill 0.41)
  Top 0.254: U2.63 30.29,20.17 33.66,23.54 v34.34,23.54 | U3.18 44.6,25.25 v45.09,24.77
  Bottom 0.254: v34.34,23.54 34.37,23.57 38.26,23.57 39.46,24.77 v45.09,24.77
FSMC_D8  (via drill 0.41)
  Top 0.254: v44.45,24.13 44.07,24.51 44.07,24.52 43.83,24.75 U3.19 | U2.64 30.79,19.99 33.68,22.88 v34.92,22.88
  Bottom 0.254: v44.45,24.13 39.45,24.13 38.35,23.04 35.08,23.04 v34.92,22.88
FSMC_D9  (via drill 0.41)
  Top 0.254: v44.95,22.38 44.32,21.75 U3.25 | U2.65 31.29,18.85 v33.51,21.07
  Bottom 0.254: v44.95,22.38 43.52,20.95 34.65,20.95 34.45,21.15 33.58,21.15 v33.51,21.07
FSMC_D10  (via drill 0.41)
  Top 0.254: v45.51,21.57 45.44,21.57 45.12,21.25 U3.26 | U2.66 31.79,18.11 v34.19,20.52
  Bottom 0.254: v34.19,20.52 44.45,20.52 v45.51,21.57
FSMC_D11  (via drill 0.41)
  Top 0.254: v44.91,20 44.66,20.25 U3.28 | U2.67 32.28,17.7 v34.24,19.65
  Bottom 0.254: v34.24,19.65 34.41,19.82 44.74,19.82 v44.91,20
FSMC_D12  (via drill 0.41)
  Top 0.254: U3.29 44.13,19.75 44.52,19.36 45.26,19.36 v45.85,19.94 | U2.68 32.78,17.62 34.12,18.96 34.76,18.96 v34.98,19.17
  Bottom 0.254: v34.98,19.17 35.11,19.31 45.21,19.31 v45.85,19.94
FSMC_D13
  Top 0.254: U2.77 37.59,18.25 38.09,17.75 U3.33
FSMC_D14
  Top 0.254: U2.78 37.67,18.75 38.17,18.25 U3.32
FSMC_D15
  Top 0.254: U3.31 38.3,18.75 37.8,19.25 U2.79
FSMC_NE3_CE  (via drill 0.41)
  Top 0.254: v46.99,34.29 47.17,34.11 47.17,25.29 45.13,23.25 U3.22 | U2.125 26.79,35.19 v27.69,34.29
  Bottom 0.254: v27.69,34.29 v27.69,34.3 29.27,35.88 41.99,35.88 43.58,34.29 v46.99,34.29
FSMC_NOE_OE  (via drill 0.41)
  Top 0.254: U3.11 45.73,28.75 46.35,29.38 46.35,32.38 v45.72,33.02 | U2.118 30.29,34.48 v30.48,34.29
  Bottom 0.254: v30.48,34.29 31.11,34.92 40.87,34.92 42.77,33.02 v45.72,33.02
FSMC_NWE_WE  (via drill 0.41)
  Top 0.254: U3.12 45.8,28.25 46.76,29.21 46.76,33.02 46.76,33.25 v46.35,33.66 | U2.119 29.79,34.87 v29.21,34.29
  Bottom 0.254: v29.21,34.29 30.35,35.43 41.4,35.43 43.18,33.66 v46.35,33.66
GND  (via drill 0.41, 0.51)
  Top 0.254: 48.04,10.3 48.35,10.61
  Top 0.61: v4.83,29.89 4.45,29.52 CONN1.BODY@2 4.37,27.3 3.17,27.3 | CONN1.BODY@3 4.45,20.36 v4.95,19.86 | CONN1.BODY@3 4.54,22.86 5.71,22.86 | CONN1.BODY@3 4.37,22.86 3.17,22.86
  Bottom 0.61: v0.93,31.13 1.45,30.61 CONN1.BODY@6 | v4.83,29.89 4.45,29.52 CONN1.BODY@2 4.45,26.04 | CONN1.BODY@10 1.45,19.38 v0.93,18.86 | v4.95,19.86 4.45,20.36 CONN1.BODY@3 4.45,24.13 | CONN1.BODY@6 1.45,28.12 | CONN1.BODY@6 1.49,29.21 3.17,29.21 | CONN1.BODY@10 1.45,22.05 | CONN1.BODY@10 3.04,20.82
  other vias: 99.11,41.18 99.11,25 10.79,24.94 1.24,41.81 1.24,8.82 10.16,20.5 3.58,18.86 3.17,34.92 3.58,31.13 44.48,32.08 44.45,27.48 42.24,27.48 38.81,28.42 14.24,18.73 84.33,5 37.97,10.92 66.93,42.09 79.38,15.88 74.55,16 74.55,13.59 73.66,18.41 72.01,18.41 69.85,15.37 78.74,21.97 70.61,23.37 70.61,25.4 73.79,27.3 78.74,26.67 78.74,24.77 29.08,13.08 34.29,12.57 39.24,13.34 34.29,10.79 17.12,26.01 25.02,36.83 35.56,33.02 16.89,36.83 22.91,30.35 19.3,32.49 22.86,25.04 31.27,25.15 32.84,30.35 39.73,23.42 39.5,21.59 35.28,21.84 34.01,17.78 26.29,16.13 19.46,16.1 17.4,16.1 17.27,18.9 14.61,15.21 16.56,13.44 11.46,13.06 9.3,15.24 6.99,7.37 16.08,6.07 20.62,5.99 25.3,6.88 24.18,9.55 23.67,12.6 23.8,16.48 27.56,10.13 34.82,6.88 36.86,2.16 44.27,2.21 49.02,15.49 50.42,29.08 50.55,22.1 48.26,10.29 52.83,10.29 12.57,30.38 12.95,26.08 74.8,7.11 65.15,7.11 69.98,4.95 8.49,1.08 91.67,1.08 98.66,8.06 91.67,48.7 50.02,48.83 8.23,48.79 3.28,41.3 18.9,45.74 23.62,37.72 29.97,40.13 25.65,39.75 32.77,40.13 41.66,45.72 49.91,38.73 49.91,39.88 52.2,38.73 56.13,41.53 62.36,41.4 63.5,41.53 70.1,30.73 71.88,36.45 80.26,35.56 82.3,36.7 84.07,40.39 85.34,43.81 80.01,45.97 74.55,44.32 72.14,44.45 66.55,44.2 3.28,39.14 83.95,11.18 80.26,12.06 85.34,13.72 84.07,16.13 80.9,20.45 80.77,23.37 80.9,28.07 80.64,30.99 74.55,11.18 71.75,10.79 65.41,10.54 66.04,22.61 61.34,13.21 55.75,15.75 89.79,21.21 89.79,18.67 89.92,14.99 93.09,10.41 92.96,26.54 92.96,29.97 93.09,33.78 86.61,9.02 35.81,40.13 37.82,26.47 50.83,33.73 37.85,33.15 47.9,33.6 38.73,40.13 29.72,36.83 54,32.84 26.67,34.29 22.73,41.27 26.29,45.85 13.21,37.34 52.83,44.45 64.77,35.05 60.07,32 55.63,29.97 60.07,20.83 58.55,15.75 19.81,19.46
  pour Top (isolate 0.203, rank 2): 0,50 100,50 100,0 0,0
  pour Bottom (isolate 0.203, rank 2): 0,50 100.12,50 arc-3 100.12,0 0,0
IO_ADC/DAC  (via drill 0.51)
  Top 0.305: v76.2,9.65 74.64,9.65 R9.1
  Bottom 0.305: J4.5 87.09,26.27 90.81,22.55 90.81,12.7 88.27,10.16 76.71,10.16 v76.2,9.65
LAT_AUX0
  Top 0.254: U3.97 70.09,28.25 75.33,33.49 IC3.14
LAT_AUX1
  Top 0.254: U3.91 66.44,25.25 67.06,24.62 70.98,24.62 72.46,26.1 72.46,27.24 74.05,28.82 74.06,28.84 75.46,30.24 IC3.19
LAT_CLK
  Top 0.254: U3.94 70.65,26.75 75.44,31.54 IC3.17
LAT_CS
  Top 0.254: U3.96 70.29,27.75 75.38,32.84 IC3.15
LAT_MISO
  Top 0.254: U3.95 70.37,27.25 75.31,32.19 IC3.16
LAT_MOSI
  Top 0.254: U3.93 70.89,26.25 75.53,30.89 IC3.18
LAT_OE  (via drill 0.41, 0.51)
  Top 0.254: v66.17,24.51 65.93,24.75 U3.90 | v79.12,29.46 79.16,29.46 79.28,29.59 IC3.1
  Bottom 0.254: v66.17,24.51 71.12,29.46 v79.12,29.46
LAT_SWV33
  Top 0.254: U3.98 69.89,28.75 75.28,34.14 IC3.13
LAT_SWV50
  Top 0.254: U3.99 69.74,29.25 75.28,34.79 IC3.12
LD1  (via drill 0.41)
  Top 0.254: R14.2 54.92,47.03 v53.85,47.03 | U2.110 34.28,36.37 34.51,36.59 34.51,45.37 34.29,45.59 v34.29,45.64
  Bottom 0.254: v53.85,47.03 49.74,47.03 48.9,47.88 35.53,47.88 34.29,46.63 v34.29,45.64
MCU_AUX1  (via drill 0.41)
  Top 0.254: U3.137 48.84,34.74 v48.51,34.42 | U2.111 33.78,36.8 v33.76,36.83
  Bottom 0.254: v48.51,34.42 46.13,36.8 33.78,36.8 v33.76,36.83
MCU_AUX2  (via drill 0.41)
  Top 0.254: U3.136 49.34,34.51 v49.43,34.42 | U2.112 33.28,36.39 33.1,36.58 v33.1,37.39
  Bottom 0.254: v49.43,34.42 46.46,37.39 34.24,37.39 34.11,37.52 33.22,37.52 v33.1,37.39
MCU_AUX3  (via drill 0.41)
  Top 0.254: U3.135 49.84,35 v50.29,34.54 | U2.113 32.78,36.28 32.26,36.8 v32.26,36.88
  Bottom 0.254: v50.29,34.54 46.76,38.08 32.74,38.08 32.26,37.59 v32.26,36.88
MCU_AUX4  (via drill 0.41)
  Top 0.254: v49.28,36.71 49.88,36.71 50.34,36.24 U3.134 | U2.122 28.29,36.61 v28.07,36.83
  Bottom 0.254: v49.28,36.71 47.48,38.5 29.74,38.5 v28.07,36.83
MCU_AUX5  (via drill 0.41)
  Top 0.254: U3.125 54.84,40.54 v53.85,41.53 | U2.139 19.79,36.98 18.8,37.97 v18.8,38.61
  Bottom 0.254: v53.85,41.53 53.58,41.53 52.95,42.16 22.35,42.16 v18.8,38.62 v18.8,38.61
MCU_AUX6  (via drill 0.41)
  Top 0.254: v53.85,42.39 54.08,42.16 54.11,42.16 55.34,40.94 U3.124 | U2.140 19.29,36.91 18.17,38.03 v18.17,39.24
  Bottom 0.254: v18.17,39.24 v18.17,39.25 21.49,42.57 53.67,42.57 v53.85,42.39
MCU_AUX7  (via drill 0.41)
  Top 0.254: U2.141 18.79,36.84 17.76,37.86 17.76,38.12 v17.53,38.35 | U3.119 57.84,36.78 56.91,37.7 56.91,41.9 56.52,42.29 v55.5,42.29
  Bottom 0.254: v17.53,38.35 17.53,39.57 20.99,43.03 54.76,43.03 v55.5,42.29
MCU_AUX8  (via drill 0.41)
  Top 0.254: v16.67,38.1 17.25,37.52 17.43,37.52 18.29,36.66 U2.142 | U3.118 58.34,36.91 57.32,37.93 57.32,42.2 56.59,42.93 v56.13,42.93
  Bottom 0.254: v16.67,38.1 16.67,39.28 20.82,43.43 55.24,43.43 55.63,43.43 v56.13,42.93
MCU_AUX9  (via drill 0.41)
  Top 0.254: U3.37 45.34,14.61 v44.58,14.61 | U2.53 25.29,17.4 25.4,17.52 25.4,18.67 25.78,19.05 v26.04,19.05
  Bottom 0.254: v26.04,19.05 30.23,19.05 31.11,18.16 31.11,15.88 32.89,14.1 35.56,14.1 | v44.58,14.61 44.45,14.61 43.94,14.1 38.78,14.1 35.56,14.1 | 35.56,14.1
MCU_AUX10  (via drill 0.41)
  Top 0.254: U3.38 45.84,14.99 45.59,15.24 v45.16,15.24 | U2.46 21.79,18.41 21.79,18.99 v22.1,19.3
  Bottom 0.254: v45.16,15.24 44.31,15.24 43.59,14.52 36.2,14.52 33.1,14.52 31.72,15.9 31.72,18.26 30.29,19.68 22.48,19.68 v22.1,19.3
MCU_AUX11  (via drill 0.41)
  Top 0.254: U3.39 46.34,15.29 v45.75,15.88 | v21.34,19.81 21.29,19.76 U2.45
  Bottom 0.254: v45.75,15.88 44.37,15.88 43.43,14.93 33.46,14.93 32.33,16.06 32.33,18.36 30.59,20.09 21.61,20.09 v21.34,19.81
MCU_AUX12  (via drill 0.41)
  Top 0.254: U3.41 47.34,15.4 v46.74,16 | v20.7,20.45 20.7,15.66 19.79,14.74 U2.42
  Bottom 0.254: v20.7,20.45 20.75,20.5 30.88,20.5 32.86,18.52 32.86,16.29 33.78,15.37 43.18,15.37 44.32,16.51 46.27,16.51 46.74,16.04 v46.74,16
MCU_INT0  (via drill 0.41, 0.51)
  Top 0.254: U2.1 24.23,33.75 v24.77,34.29 | U3.129 52.84,36.77 52.7,36.9 v52.7,36.93
  Bottom 0.254: v52.7,36.93 50.8,36.93 48.39,39.34 28.67,39.34 24.77,35.43 v24.77,34.29
MCU_INT1  (via drill 0.41, 0.51)
  Top 0.254: v52.96,33.83 53.34,34.21 U3.128 | U2.2 25,33.25 v25.65,33.91
  Bottom 0.254: v52.96,33.83 52.96,34.08 48.13,38.91 28.82,38.91 25.65,35.75 v25.65,33.91
MCU_MCO
  Top 0.254: U3.20 42.83,24.25 41.4,25.68 41.4,26.84 38.49,29.75 U2.100
MS0  (via drill 0.41)
  Top 0.254: U2.50 23.79,15.33 v23.62,15.49 | v26.42,10.06 30.48,5.99 30.48,3.1
  Top 0.305: SW2.1 30.48,3.1 SW2.2
  Bottom 0.254: v23.62,15.49 23.62,13.84 26.42,11.05 v26.42,10.06
N$1  (via drill 0.51)
  Bottom 0.61: v52.07,6.6 56.52,6.6 v57.15,5.97
  pour Top (no thermals): 52.58,7.67 50.8,7.67 50.8,6.14 52.58,6.14
  pour Top (no thermals): 58.55,6.4 56.77,6.4 56.77,5.13 58.55,5.13
N$2
  Top 0.254: RN4.6 82.78,6.75 81.33,8.21 IC16.1
N$3
  Top 0.254: IC16.4 79.38,9.01 79.73,9.37 81.76,9.37 83.48,7.64 RN4.5
N$4
  Top 0.254: RN4.8 85.77,2.58 84.84,1.65 78.19,1.65 77.42,2.42 IC16.8
N$5
  Top 0.254: RN4.7 79.99,5.95 78.72,4.68 IC16.10
N$6  (via drill 0.41)
  Top 0.305: R14.1 v57.81,47 LED4.A
  Bottom 0.305: v57.81,47 LED4.A
N$7  (via drill 0.41)
  Top 0.305: R13.1 v22.7,47 LED1.A
  Bottom 0.305: LED1.A v22.7,47
N$8
  Top 0.254: XTAL1.2 13.17,23.04 C18.2 13.46,23.2 13.91,22.75 U2.23
N$9
  Top 0.254: U2.24 13.99,22.25 13.42,21.68 | 13.42,21.68 C16.2 | XTAL1.1 11.18,18.97 11.18,19.44 13.42,21.68
N$13  (via drill 0.41)
  Top 0.305: LED8.A v42.51,47 R18.1
  Bottom 0.305: v42.51,47 LED8.A
N$18  (via drill 0.41)
  Top 0.305: R17.1 v77.62,47 LED6.A
  Bottom 0.305: LED6.A v77.62,47
PWM
  Top 0.254: U2.96 39.11,27.75 39.77,27.09 39.77,24.68 40.7,23.75 U3.21
RST  (via drill 0.41)
  Top 0.254: SW1.1 SW1.2 66.8,3.05 65.02,1.27 19.68,1.27 14.33,6.63 v14.33,10.16 | U2.25 16.35,21.75 v16.51,21.59 | R5.1 14.58,10.41 v14.33,10.16 | C14.2 v14.33,10.16
  Bottom 0.254: v16.51,21.59 16.51,15.01 14.33,12.83 v14.33,10.16
SRAM0_CLOCK
  Top 0.254: 46.84,37.52 46.89,37.56 | 46.89,37.56 47.05,37.72 47.05,41.29 47.62,41.87 IC1.6 | U3.141 46.84,37.52 | 46.84,37.52 46.89,37.56
SRAM0_CS
  Top 0.254: U3.144 45.34,37.48 45.11,37.71 45.11,39.28 | 45.11,39.28 IC1.1 45.11,39.28
SRAM0_SIO0
  Top 0.254: U3.138 48.34,37.9 48.32,37.92 48.32,41.16 48.66,41.51 48.9,41.74 IC1.5
SRAM0_SIO1
  Top 0.254: U3.142 46.34,38.73 | 46.34,38.73 46.34,39.29 | IC1.2 46.34,39.29 | 46.34,39.29 46.34,38.73
SRAM0_SIO2
  Top 0.254: U3.139 47.84,37.39 47.69,37.53 47.62,37.6 IC1.3
SRAM0_SIO3
  Top 0.254: U3.143 45.84,37.83 45.78,37.89 45.78,41.34 46.35,41.91 IC1.7
SRAM1_CLOCK
  Top 0.254: U3.114 60.34,41.86 60.96,42.48 IC2.6
SRAM1_CS
  Top 0.254: U3.117 58.84,36.99 58.42,37.41 IC2.1
SRAM1_SIO0
  Top 0.254: U3.112 61.34,37.51 61.54,37.71 61.54,41.73 62.23,42.42 IC2.5
SRAM1_SIO1
  Top 0.254: U3.115 59.84,39.16 IC2.2
SRAM1_SIO2
  Top 0.254: U3.113 60.84,39.19 IC2.3
SRAM1_SIO3
  Top 0.254: U3.116 59.34,37.48 59.11,37.71 59.11,42.15 59.69,42.73 IC2.7
SWCLK
  Top 0.254: J2.4 35.56,45.09 34.91,44.44 34.91,36.26 34.78,36.13 U2.109
SWDIO
  Top 0.254: J2.3 34.12,47.45 36.27,47.45 36.66,47.06 36.66,40.18 37.13,39.71 37.13,36.75 38.71,35.16 38.71,33.11 37.85,32.25 U2.105
SWV33  (via drill 0.41, 0.51)
  Top 0.254: IC3.8 83.98,34.14 J4.3 | RN1.3 18.82,5.06 19.38,4.5 21.59,4.5 v22.23,3.86
  Bottom 0.254: v54.86,2.8 50.24,2.8 49.18,3.86 v22.23,3.86
  Bottom 0.61: v54.86,2.8 87.37,2.8 94.22,9.65 94.22,26.89 89.76,31.35 J4.3
  pour Top (no thermals): 56.39,5.51 50.8,5.51 50.8,2.59 56.39,2.59
SWV50  (via drill 0.41, 0.51)
  Top 0.254: IC3.9 84.92,34.79 85.82,33.89 J4.2 | RN1.2 18.02,5.1 19.3,3.81 v20.95,3.81
  Bottom 0.254: v20.95,3.81 21.59,3.17 v48.9,3.17
  Bottom 0.61: v48.9,3.17 50.8,1.27 87.88,1.27 95.64,9.04 95.64,29.45 91.2,33.89 J4.2
  pour Top (no thermals): 49.66,5.76 46.99,5.76 46.99,2.59 49.66,2.59
UART_RX
  Top 0.254: U2.137 20.79,37.28 19.89,38.18 19.89,41.7 18.41,43.18 J3.2
UART_TX
  Top 0.254: U2.136 21.29,37.36 20.3,38.34 20.3,42.48 17.07,45.72 J3.3
USB_D+  (via drill 0.41)
  Top 0.254: v18.46,31.97 18.68,31.75 34.7,31.75 U2.104 | R3.1 10.67,29.35 v10.67,31.8
  Bottom 0.254: v10.67,31.8 10.85,31.98 16.51,31.98 v18.46,31.98 v18.46,31.97
USB_D-  (via drill 0.41)
  Top 0.254: v17.78,31.29 17.82,31.25 34.78,31.25 U2.103 | R2.1 10.03,29.22 v10.03,31.16
  Bottom 0.254: v10.03,31.16 17.65,31.16 v17.78,31.29
USB_DET
  Top 0.254: U2.3 14.33,32.75 14.21,32.87 12.97,32.87 11.96,31.86 11.89,31.79 11.89,29.4 R1.2
USBLED
  Top 0.254: R18.2 45.35,47.99 44.9,48.44 30.03,48.44 29.21,47.62 29.21,45.09 30.79,43.51 U2.117
V33PU  (via drill 0.41)
  Top 0.254: U2.56 26.79,13.53 31.59,8.72 35.73,8.72 v37.52,6.93 37.7,6.75 RN3.7 | IC15.6 57.69,7.25 v57.53,7.09
  Bottom 0.254: v57.53,7.09 56.86,7.09 56.66,7.29 49.53,7.29 48.54,6.3 47.98,6.3 38.15,6.3 v37.52,6.93
V50PU  (via drill 0.41)
  Top 0.254: U2.57 27.29,13.6 31.63,9.26 36.34,9.26 38.48,7.12 v38.48,6.99 38.5,6.97 RN3.6 | v48.26,6.99 49.5,6.99 49.52,7 IC14.6
  Bottom 0.254: v38.48,6.99 v48.26,6.99
VEXTERN  (via drill 0.41, 0.51)
  Top 0.254: RN2.2 22.46,5.35 23.11,4.7 26.11,4.7 v26.16,4.65
  Bottom 0.254: v60.64,4.35 60.66,4.37 26.44,4.37 v26.16,4.65
  Bottom 0.457: v60.64,4.35 60.64,4.08 86.86,4.08 92.12,9.34 92.12,25.36 88.67,28.81 J4.4
  pour Top (no thermals): 61.59,5.76 59.69,5.76 59.69,3.81 61.59,3.81
VEXTPU  (via drill 0.41, 0.51)
  Top 0.254: IC16.5 IC16.6 78.11,8.61 v78.11,6.99 | IC16.13 IC16.12 80.01,2.81 v80.01,4.95 | U2.55 26.29,13.45 31.48,8.26 35.18,8.26 v36.58,6.86 36.8,6.63 RN3.8
  Bottom 0.254: v80.01,4.95 80.01,5.08 v78.11,6.99 77.52,6.4 60.01,6.4 58.89,5.28 56.87,5.28 56.26,5.89 37.59,5.89 36.62,6.86 v36.58,6.86
VPUN  (via drill 0.41, 0.51)
  Top 0.254: IC16.3 IC16.2 | IC16.11 79.38,2.42 79.02,2.06 78.43,2.06 78.08,2.42 IC16.9 | v26.92,5.33 25.91,5.33 25.73,5.16 23.47,5.16 23.26,5.37 RN2.3 | IC11.6 81.38,42.86 C48.2 | IC13.6 72.49,42.86 C49.2 | IC10.6 v81.15,26.6 | C46.2 72.74,17.14 72.42,16.82 IC9.6 | IC8.6 82.02,16.82 C45.2
  Top 0.305: IC16.9 78.08,5.68 v78.11,5.71 | C49.2 73.03,43.4 v73.03,45.09 | v82.55,45.09 82.33,44.87 C48.2 | IC16.3 80.03,7 80.01,6.99 | IC9.6 69.92,16.82 v69.85,16.89 | v83.95,17.27 83.61,16.93 C45.2 | C47.2 82.02,26.6 v81.15,26.6 | v89.79,19.94 90.81,19.94
  Top 0.406: v89.76,17.4 90.81,17.4
  Top 0.457: v90.81,10.16 90.81,17.27 90.81,17.4 90.81,19.94 90.81,41.91 87.63,45.09 v82.55,45.09 | v78.11,5.71 78.74,5.71 80.01,6.99 v81.28,6.99
  Bottom 0.254: v26.92,5.33 27.48,4.78 58.96,4.78 59.9,5.71 v62.87,5.71
  Bottom 0.305: 82.48,45.11 82.5,45.09 | v69.85,16.89 76.45,16.89 78.74,14.61 81.4,14.61 83.95,17.16 v83.95,17.27 | v81.15,26.6 81.73,26.6 82.55,25.78 82.55,22.23 84.84,19.94 v89.79,19.94 | v89.79,19.94 89.92,19.94 v89.79,19.94
  Bottom 0.406: v89.76,17.4 84.07,17.4 v83.95,17.27
  Bottom 0.457: v62.87,5.71 v78.11,5.71 | 82.5,45.09 v82.55,45.09 | 82.48,45.11 73.03,45.11 v73.03,45.09 | v90.81,10.16 88.77,8.13 82.42,8.13 v81.28,6.99
  pour Top (no thermals): 63.5,7.67 59.69,7.67 59.69,6.35 62.23,6.35 62.23,5.08 63.5,5.08
VREGEN  (via drill 0.41)
  Top 0.254: R4.1 44.27,7.65 VR4.3 45.41,10.47 v45.09,10.79 | VR2.3 53.66,8.82 54.99,10.15 v54.99,10.92 | U2.54 25.79,13.21 25.8,13.2 25.8,12.94 v28.7,10.03 | v61.19,32.89 64.77,36.47 64.77,44.45 67.32,47 R17.2
  Bottom 0.254: v28.7,10.03 44.32,10.03 v45.09,10.79 45.34,11.05 54.86,11.05 v54.99,10.92 55.22,11.15 58.91,11.15 60.71,12.95 60.71,13.64 61.19,14.12 v61.19,32.89
VUSB  (via drill 0.41, 0.51)
  Top 0.254: R11.1 v6.99,14.61 | C53.1 51.56,8.51 51.31,8.26 50.16,8.26 50.16,8.13 | 50.16,8.13 v48.01,8.13 48.01,7.75 47.4,7.75 VR4.1 | VR2.1 55.66,7.75 57.28,7.75 v57.28,8.38 59.05,8.38 IC15.5 | IC14.5 50.16,8.13
  Bottom 0.254: v57.28,8.38 49.02,8.38 48.9,8.26 | v48.01,8.13 46.48,8.13 46.35,8.26 | v41.15,8.38 41.78,8.38 41.91,8.26
  Bottom 0.406: 57.15,8.26 78.11,8.26 81.36,5 v81.66,5
  Bottom 1.219: 57.15,8.26 48.9,8.26 46.35,8.26 41.91,8.26 10.16,8.26 6.99,11.43 v6.99,14.61 | v6.35,34.92 6.99,35.56 v6.99,35.73 6.99,39.5 7.87,40.39 11.43,40.39 12.95,41.91 12.95,46.73 13.72,47.5 15.62,47.5 16.45,46.67 16.45,44.9 16.84,44.5 v39.37,44.5
  other vias: 7.62,34.97 7.75,33.02 6.35,31.11 7.75,31.11 38.1,44.5 40.26,8.13 48.9,8.51 56.39,8.13
  pour Bottom: 5.71,36.37 8.26,36.37 8.26,10.59 5.71,10.59
  pour Top: 8.26,36.37 5.71,36.37 5.71,29 8.26,29
  pour Top (no thermals): 37.47,45.13 40.01,45.13 40.01,41.45 37.47,41.45
  pour Top (no thermals): 41.53,12.88 39.88,12.88 39.88,7.67 41.53,7.67
  pour Top (no thermals): 50.42,7.37 50.42,8.26 52.07,8.26 52.07,11.05 51.05,11.05 51.05,8.9 46.99,8.9 46.99,7.37
  pour Top (no thermals): 59.18,8.94 55.12,8.94 55.12,7.03 59.18,7.03
  pour Top (no thermals): 83.44,5.51 81.15,5.51 81.15,2.84 83.44,2.84

## Text on the board
tPlace: PWR | USB | MODE | VREG | BOOT | UART | TX | RX | GND | Ian Lesnet | I+S 2019 | SMDPRUTSER | v.trocio | MAY 2019 | Bus Pirate Ultra v1.0a
bPlace: PWR | USB | MODE | VREG | GND | +5V | 3V3 | VPU | ADC/DAC | Bus Pirate Ultra v1.0a | http://dangerousprototypes.com | https://smdprutser.nl | AUX | CS | MAY 2019 | MISO | CLK | MOSI | Fulfillment by | Seeed Studio | www.seeedstudio.com
tNames: 3.3V | GND | SW- / DIO | SW- / CLK | B0 | B1
tValues: vimark
Reference: GND | +5v | +3v3 | Vpu | USB | ADC/DAC | I/O header | AUX0 | CS | MISO | CLK | MOSI | BUS PIRATE Ultra | Ian Lesnet MAY 2019 | http://dangerousprototypes.com | CC-0